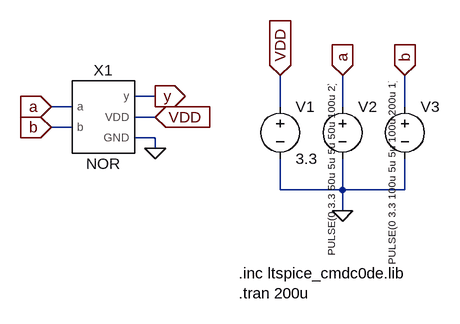
[diagram p0: schematic nor_test.asc]
nor_test.asc, the LTspice schematic file:
Version 4.1
SHEET 1 880 680
WIRE 256 96 224 96
WIRE 128 112 96 112
WIRE 448 112 448 64
WIRE 544 112 544 64
WIRE 640 112 640 64
WIRE 256 128 224 128
WIRE 128 144 96 144
WIRE 256 160 224 160
WIRE 256 176 256 160
WIRE 448 240 448 192
WIRE 544 240 544 192
WIRE 544 240 448 240
WIRE 640 240 640 192
WIRE 640 240 544 240
WIRE 544 272 544 240
FLAG 256 176 0
FLAG 544 272 0
FLAG 448 64 VDD
IOPIN 448 64 In
FLAG 544 64 a
IOPIN 544 64 In
FLAG 640 64 b
IOPIN 640 64 In
FLAG 96 112 a
IOPIN 96 112 In
FLAG 96 144 b
IOPIN 96 144 In
FLAG 256 96 y
IOPIN 256 96 Out
FLAG 256 128 VDD
IOPIN 256 128 In
SYMBOL nor 176 128 R0
SYMATTR InstName X1
SYMBOL voltage 448 96 R0
WINDOW 123 0 0 Left 0
WINDOW 39 0 0 Left 0
SYMATTR InstName V1
SYMATTR Value 3.3
SYMBOL voltage 544 96 R0
WINDOW 3 -17 246 VLeft 1
WINDOW 123 0 0 Left 0
WINDOW 39 0 0 Left 0
SYMATTR InstName V2
SYMATTR Value PULSE(0 3.3 50u 5u 5u 50u 100u 2)
SYMBOL voltage 640 96 R0
WINDOW 3 -20 260 VLeft 1
WINDOW 123 0 0 Left 0
WINDOW 39 0 0 Left 0
SYMATTR InstName V3
SYMATTR Value PULSE(0 3.3 100u 5u 5u 100u 200u 1)
TEXT 384 368 Left 2 !.inc ltspice_cmdc0de.lib\n.tran 200u

The netlist it stands for:
* nor_test.asc
X§X1 a b y VDD 0 NOR NOR  ; pins a b y VDD GND
V1 VDD 0 3.3
V2 a 0 PULSE(0 3.3 50u 5u 5u 50u 100u 2)
V3 b 0 PULSE(0 3.3 100u 5u 5u 100u 200u 1)
.inc ltspice_cmdc0de.lib
.tran 200u
.lib yap_cells.lib
.backanno
.end